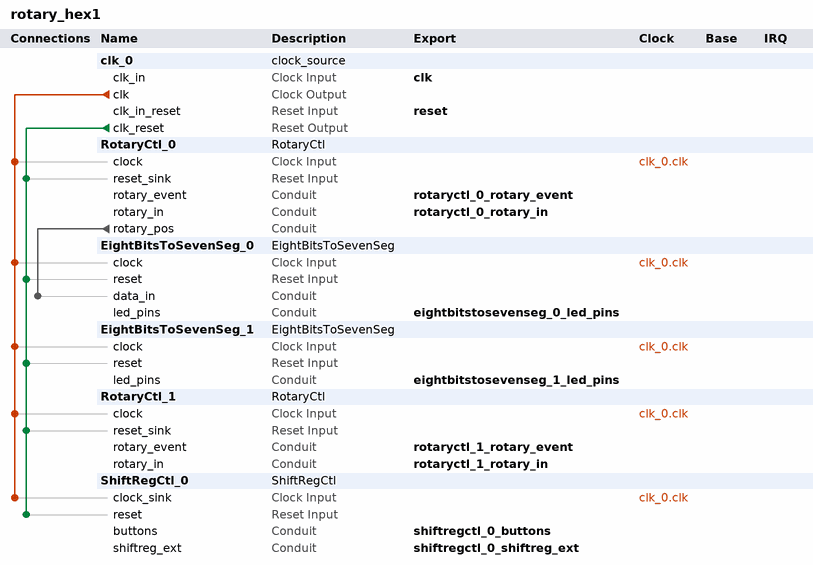
[diagram p0: system contents]
# Platform Designer (Qsys) system rotary_hex1, Cyclone V 5CSEMA5F31C6
# Parameters at their usual value, and those the tool derives, are not listed.
package require -exact qsys 16.1
create_system rotary_hex1
set_project_property DEVICE_FAMILY {Cyclone V}
set_project_property DEVICE 5CSEMA5F31C6

add_instance clk_0 clock_source 16.1
set_instance_parameter_value clk_0 clockFrequency 50000000

add_instance RotaryCtl_0 RotaryCtl 1.0

add_instance EightBitsToSevenSeg_0 EightBitsToSevenSeg 1.0

add_instance EightBitsToSevenSeg_1 EightBitsToSevenSeg 1.0

add_instance RotaryCtl_1 RotaryCtl 1.0

add_instance ShiftRegCtl_0 ShiftRegCtl 1.0

# connections
add_connection clk_0.clk EightBitsToSevenSeg_0.clock clock
add_connection clk_0.clk EightBitsToSevenSeg_1.clock clock
add_connection clk_0.clk RotaryCtl_0.clock clock
add_connection clk_0.clk RotaryCtl_1.clock clock
add_connection clk_0.clk ShiftRegCtl_0.clock_sink clock
add_connection clk_0.clk_reset EightBitsToSevenSeg_0.reset reset
add_connection clk_0.clk_reset EightBitsToSevenSeg_1.reset reset
add_connection clk_0.clk_reset RotaryCtl_0.reset_sink reset
add_connection clk_0.clk_reset RotaryCtl_1.reset_sink reset
add_connection clk_0.clk_reset ShiftRegCtl_0.reset reset
add_connection RotaryCtl_0.rotary_pos EightBitsToSevenSeg_0.data_in conduit

# exported interfaces
add_interface clk clock sink
set_interface_property clk EXPORT_OF clk_0.clk_in
add_interface eightbitstosevenseg_0_led_pins conduit end
set_interface_property eightbitstosevenseg_0_led_pins EXPORT_OF EightBitsToSevenSeg_0.led_pins
add_interface eightbitstosevenseg_1_led_pins conduit end
set_interface_property eightbitstosevenseg_1_led_pins EXPORT_OF EightBitsToSevenSeg_1.led_pins
add_interface reset reset sink
set_interface_property reset EXPORT_OF clk_0.clk_in_reset
add_interface rotaryctl_0_rotary_event conduit end
set_interface_property rotaryctl_0_rotary_event EXPORT_OF RotaryCtl_0.rotary_event
add_interface rotaryctl_0_rotary_in conduit end
set_interface_property rotaryctl_0_rotary_in EXPORT_OF RotaryCtl_0.rotary_in
add_interface rotaryctl_1_rotary_event conduit end
set_interface_property rotaryctl_1_rotary_event EXPORT_OF RotaryCtl_1.rotary_event
add_interface rotaryctl_1_rotary_in conduit end
set_interface_property rotaryctl_1_rotary_in EXPORT_OF RotaryCtl_1.rotary_in
add_interface shiftregctl_0_buttons conduit end
set_interface_property shiftregctl_0_buttons EXPORT_OF ShiftRegCtl_0.buttons
add_interface shiftregctl_0_shiftreg_ext conduit end
set_interface_property shiftregctl_0_shiftreg_ext EXPORT_OF ShiftRegCtl_0.shiftreg_ext

set_interconnect_requirement {$system} qsys_mm.clockCrossingAdapter HANDSHAKE
set_interconnect_requirement {$system} qsys_mm.enableEccProtection FALSE
set_interconnect_requirement {$system} qsys_mm.insertDefaultSlave FALSE
set_interconnect_requirement {$system} qsys_mm.maxAdditionalLatency 1

save_system rotary_hex1.qsys
